# EAGLE design G223D (EAGLE 6.6.0)
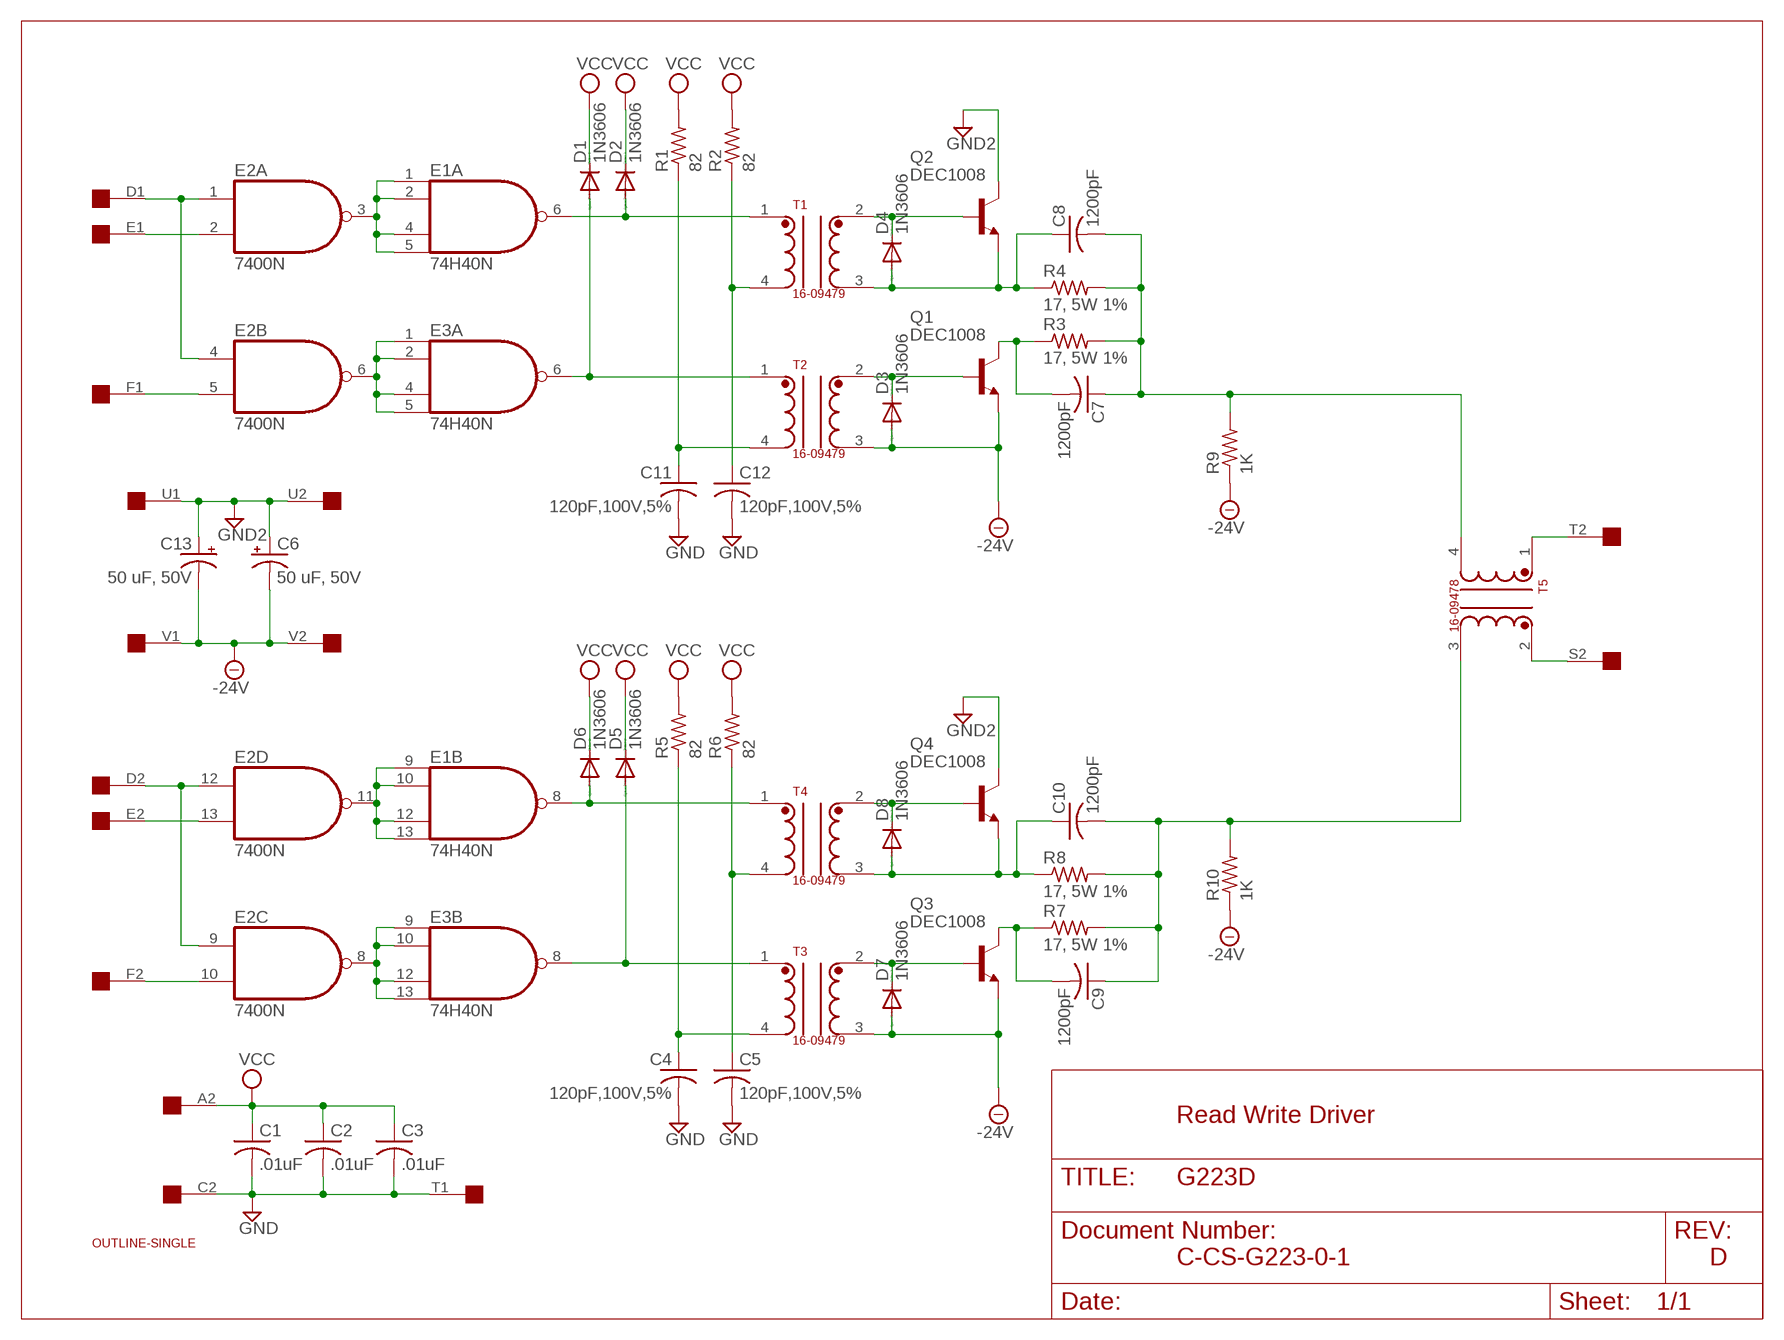
[diagram p0: schematic, sheet 1]

## Parts
C1  .01uF  C-US050-025X075  [C050-025X075]
C2  .01uF  C-US050-025X075  [C050-025X075]
C3  .01uF  C-US050-025X075  [C050-025X075]
C4  120pF,100V,5%  C-US075-032X103  [C075-032X103]
C5  120pF,100V,5%  C-US075-032X103  [C075-032X103]
C6  50 uF, 50V  CPOL-USE30-10AXIAL  [E30-10]
C7  1200pF  C-US075-032X103  [C075-032X103]
C8  1200pF  C-US075-032X103  [C075-032X103]
C9  1200pF  C-US075-032X103  [C075-032X103]
C10  1200pF  C-US075-032X103  [C075-032X103]
C11  120pF,100V,5%  C-US075-032X103  [C075-032X103]
C12  120pF,100V,5%  C-US075-032X103  [C075-032X103]
C13  50 uF, 50V  CPOL-USE30-10AXIAL  [E30-10]
D1  1N3606  DIODE-DO35-10  [DO35-10]
D2  1N3606  DIODE-DO35-10  [DO35-10]
D3  1N3606  DIODE-DO35-10  [DO35-10]
D4  1N3606  DIODE-DO35-10  [DO35-10]
D5  1N3606  DIODE-DO35-10  [DO35-10]
D6  1N3606  DIODE-DO35-10  [DO35-10]
D7  1N3606  DIODE-DO35-10  [DO35-10]
D8  1N3606  DIODE-DO35-10  [DO35-10]
E1  74H40N  74S40N  [DIL14]
E2  7400N  [DIL14]
E3  74H40N  74S40N  [DIL14]
EDGE1  EDGE-2CONNECTOR  [EDGE-CON2]
Q1  DEC1008  -NPN-TO5  [TO5]
Q2  DEC1008  -NPN-TO5  [TO5]
Q3  DEC1008  -NPN-TO5  [TO5]
Q4  DEC1008  -NPN-TO5  [TO5]
R1  82  R-US_0207/10  [0207/10]
R2  82  R-US_0207/10  [0207/10]
R3  17, 5W 1%  R-US_VTA52  [VTA52]
R4  17, 5W 1%  R-US_VTA52  [VTA52]
R5  82  R-US_0207/10  [0207/10]
R6  82  R-US_0207/10  [0207/10]
R7  17, 5W 1%  R-US_VTA52  [VTA52]
R8  17, 5W 1%  R-US_VTA52  [VTA52]
R9  1K  R-US_0207/10  [0207/10]
R10  1K  R-US_0207/10  [0207/10]
T1  16-09479  [TRANSFORMER-SIL4]
T2  16-09479  [TRANSFORMER-SIL4]
T3  16-09479  [TRANSFORMER-SIL4]
T4  16-09479  [TRANSFORMER-SIL4]
T5  16-09478  16-09479  [TRANSFORMER-SIL4]
U$1  OUTLINE-SINGLE  [SINGLE]

## Nets
-24V [supply]: C6.- C13.- D3.A D7.A EDGE1.V1 EDGE1.V2 Q1.1(E) Q3.1(E) R9.1 R10.1 T2.3 T3.3
GND [supply]: C1.2 C2.2 C3.2 C4.2 C5.2 C11.2 C12.2 EDGE1.C2 EDGE1.T1
GND2 [supply]: C6.+ C13.+ EDGE1.U1 EDGE1.U2 Q2.3(C) Q4.3(C)
N$1: E1.1(A:I0) E1.2(A:I1) E1.4(A:I2) E1.5(A:I3) E2.3(A:O)
N$2: E2.1(A:I0) E2.4(B:I0) EDGE1.D1
N$3: E2.2(A:I1) EDGE1.E1
N$4: E1.9(B:I0) E1.10(B:I1) E1.12(B:I2) E1.13(B:I3) E2.11(D:O)
N$5: E2.6(B:O) E3.1(A:I0) E3.2(A:I1) E3.4(A:I2) E3.5(A:I3)
N$6: E2.8(C:O) E3.9(B:I0) E3.10(B:I1) E3.12(B:I2) E3.13(B:I3)
N$7: E2.5(B:I1) EDGE1.F1
N$8: D2.A E1.6(A:O) T1.1
N$9: D1.A E3.6(A:O) T2.1
N$10: D6.A E1.8(B:O) T4.1
N$11: D5.A E3.8(B:O) T3.1
N$12: E2.9(C:I0) E2.12(D:I0) EDGE1.D2
N$13: E2.13(D:I1) EDGE1.E2
N$14: E2.10(C:I1) EDGE1.F2
N$15: EDGE1.S2 T5.2
N$16: EDGE1.T2 T5.1
N$17: C7.1 C8.2 R3.2 R4.2 R9.2 T5.4
N$18: C8.1 D4.A Q2.1(E) R4.1 T1.3
N$19: C7.2 Q1.3(C) R3.1
N$20: C9.1 C10.2 R7.2 R8.2 R10.2 T5.3
N$21: D7.C Q3.2(B) T3.2
N$23: C9.2 Q3.3(C) R7.1
N$24: C10.1 D8.A Q4.1(E) R8.1 T4.3
N$25: C11.1 R1.1 T2.4
N$26: C12.1 R2.1 T1.4
N$27: C5.1 R6.1 T4.4
N$28: C4.1 R5.1 T3.4
N$29: D3.C Q1.2(B) T2.2
N$30 [supply]: D4.C Q2.2(B) T1.2
N$31 [supply]: D8.C Q4.2(B) T4.2
VCC [supply]: C1.1 C2.1 C3.1 D1.C D2.C D5.C D6.C EDGE1.A2 R1.2 R2.2 R5.2 R6.2
Unconnected: E1.3(3:NC) E1.11(11:NC) E3.3(3:NC) E3.11(11:NC) EDGE1.A1 EDGE1.B1 EDGE1.B2 EDGE1.C1 EDGE1.H1 EDGE1.H2 EDGE1.J1 EDGE1.J2 EDGE1.K1 EDGE1.K2 EDGE1.L1 EDGE1.L2 EDGE1.M1 EDGE1.M2 EDGE1.N1 EDGE1.N2 EDGE1.P1 EDGE1.P2 EDGE1.R1 EDGE1.R2 EDGE1.S1

## Notes on the sheet
- Read Write Driver
- C-CS-G223-0-1 | D

## Power pins joined to a net without a drawn wire
GND: E1.7(P:GND) E2.7(P:GND) E3.7(P:GND)
VCC: E1.14(P:VCC) E2.14(P:VCC) E3.14(P:VCC)

## Library data of the parts
C1-C5 C7-C12 = rcl:C-US: CAPACITOR, American symbol
C6 C13 = rcl:CPOL-US: POLARIZED CAPACITOR, American symbol
D1-D8 = diode:DIODE-: DIODE
E1 E3 = dec-con:74*40: Dual 4-input NAND gate
E2 = 74xx-us:74*00: Quad 2-input NAND gate
EDGE1 = dec-con:EDGE-2: Double-Sided DEC edge connector.
Q1-Q4 = transistor:*-NPN-: NPN Transistror BF959 corrected 2008.03.06
R1-R10 = rcl:R-US_: RESISTOR, American symbol
T1-T5 = dec-con:16-09479: Simple Transformer
U$1 = dec-con:OUTLINE-*: Board outlines for DEC boards.

## Net classes
0 default: width 0.813 mm
1 supply: width 0.813 mm

## Board
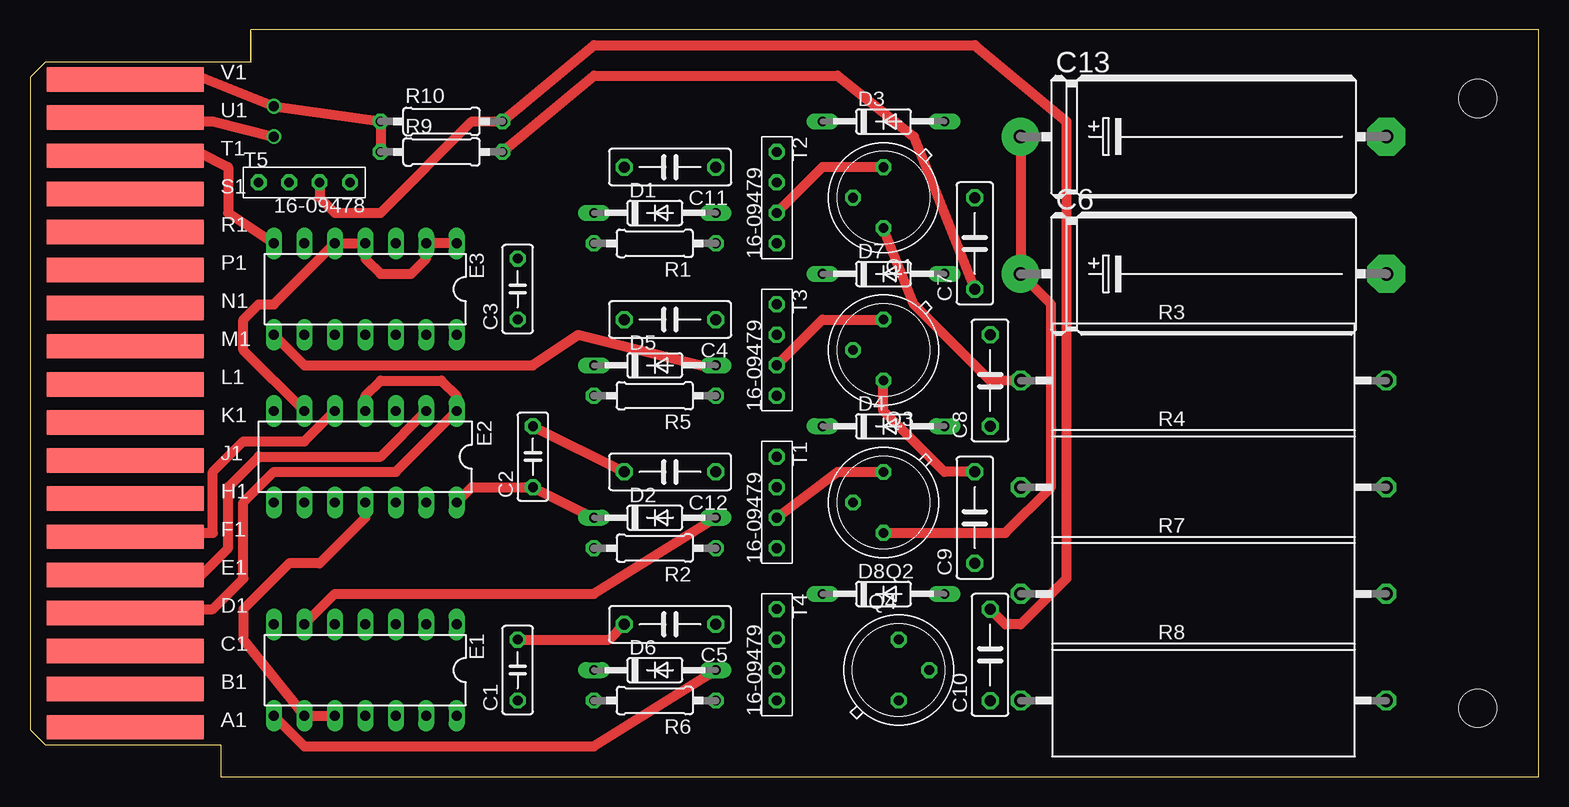
[diagram p1: board, top side]
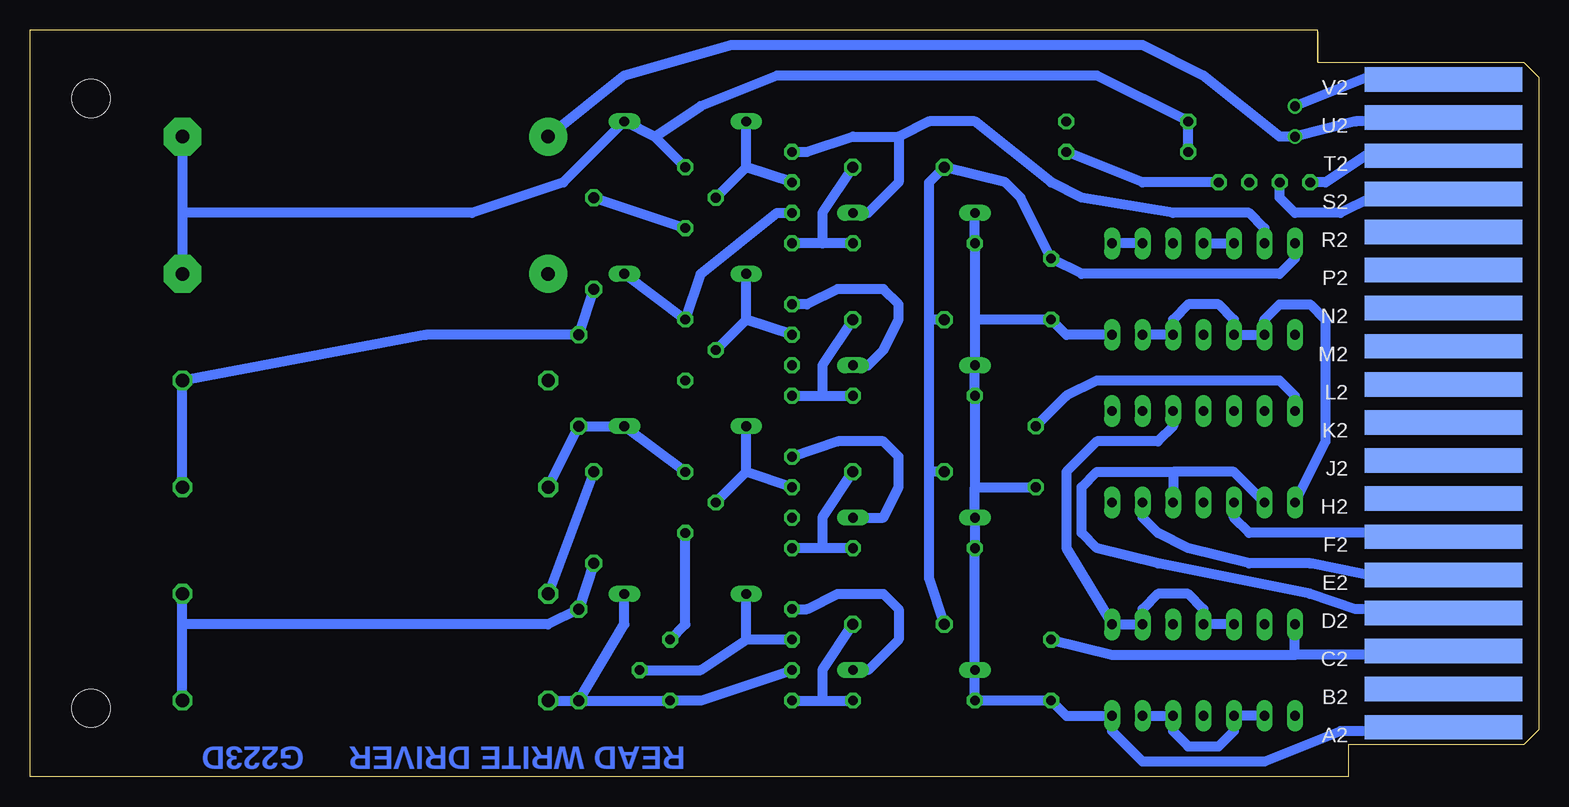
[diagram p2: board, bottom side, seen from below]

Size 125.73 x 62.23 mm. Coordinates in mm from the lower left corner, seen from the top.
Copper layers (1+16): Top 0.035mm / dielectric 1.5mm / Bottom 0.035mm
Design rules "16mils": minimum track width 16mil, minimum drill 32mil, track to track 15mil, track to pad 10mil, pad to pad 10mil, via to via 10mil, smd to smd 10mil, copper to edge 13mil, drill to drill 10mil, minimum pad ring 10mil, minimum via ring 8mil, stop-mask expansion 0mil, vias tented up to drill 0mil, thermal gap 10mil

### Footprints (pad centres in the part's own frame; a part is rotated, then mirrored left to right if it is on the bottom)
C050-025X075 = drill 0.813 octagon: 1 -2.54,0; 2 2.54,0
C075-032X103 = drill 0.914 octagon: 1 -3.81,0; 2 3.81,0
E30-10 = drill 1.118 pad 3.15: + -15.24,0 | drill 1.118 pad 3.15 octagon: - 15.24,0
DO35-10 = drill 0.813 long: A 5.08,0; C -5.08,0
DIL14 = drill 0.813 long: 1 -7.62,-3.81; 2 -5.08,-3.81; 3 -2.54,-3.81; 4 0,-3.81; 5 2.54,-3.81; 6 5.08,-3.81; 7 7.62,-3.81; 8 7.62,3.81; 9 5.08,3.81; 10 2.54,3.81; 11 0,3.81; 12 -2.54,3.81; 13 -5.08,3.81; 14 -7.62,3.81
EDGE-CON2 = smd 13.106 x 2.032: A1 7.938,4.128; B1 7.938,7.303; C1 7.938,10.477; D1 7.938,13.652; E1 7.938,16.828; F1 7.938,20.003; H1 7.938,23.177; J1 7.938,26.352; K1 7.938,29.527; L1 7.938,32.703; M1 7.938,35.877; N1 7.938,39.053; P1 7.938,42.227; R1 7.938,45.403; S1 7.938,48.578; T1 7.938,51.752; U1 7.938,54.928; V1 7.938,58.102 | smd 13.106 x 2.032 bottom: A2 7.938,4.128; B2 7.938,7.303; C2 7.938,10.477; D2 7.938,13.652; E2 7.938,16.828; F2 7.938,20.003; H2 7.938,23.177; J2 7.938,26.352; K2 7.938,29.527; L2 7.938,32.703; M2 7.938,35.877; N2 7.938,39.053; P2 7.938,42.227; R2 7.938,45.403; S2 7.938,48.578; T2 7.938,51.752; U2 7.938,54.928; V2 7.938,58.102
TO5 = drill 0.813 octagon: 1 0,-2.54; 2 2.54,0; 3 0,2.54
0207/10 = drill 0.813 octagon: 1 -5.08,0; 2 5.08,0
VTA52 = drill 1.1 octagon: 1 -15.24,0; 2 15.24,0
TRANSFORMER-SIL4 = drill 0.813 octagon: 1 -3.81,0; 2 -1.27,0; 3 1.27,0; 4 3.81,0
SINGLE = hole 3.175: 120.65,56.515; 120.65,5.715

### Placement (x,y rotation side)
C1  40.64,8.89 90 top
C2  41.91,26.67 90 top
C3  40.64,40.64 90 top
C4  53.34,38.1 180 top
C5  53.34,12.7 180 top
C6  97.79,41.91 0 top
C7  78.74,44.45 90 top
C8  80.01,33.02 90 top
C9  78.74,21.59 90 top
C10  80.01,10.16 90 top
C11  53.34,50.8 180 top
C12  53.34,25.4 180 top
C13  97.79,53.34 0 top
D1  52.07,46.99 0 top
D2  52.07,21.59 0 top
D3  71.12,54.61 0 top
D4  71.12,29.21 0 top
D5  52.07,34.29 0 top
D6  52.07,8.89 0 top
D7  71.12,41.91 0 top
D8  71.12,15.24 0 top
E1  27.94,8.89 180 top
E2  27.94,26.67 180 top
E3  27.94,40.64 180 top
EDGE1  0,0 0 top
Q1  71.12,48.26 180 top
Q2  71.12,22.86 180 top
Q3  71.12,35.56 180 top
Q4  72.39,8.89 0 top
R1  52.07,44.45 180 top
R2  52.07,19.05 180 top
R3  97.79,33.02 0 top
R4  97.79,24.13 0 top
R5  52.07,31.75 180 top
R6  52.07,6.35 180 top
R7  97.79,15.24 0 top
R8  97.79,6.35 0 top
R9  34.29,52.07 0 top
R10  34.29,54.61 0 top
T1  62.23,22.86 270 top
T2  62.23,48.26 270 top
T3  62.23,35.56 270 top
T4  62.23,10.16 270 top
T5  22.86,49.53 0 top
U$1  0,0 0 top

### Tracks (layer width: path | path; a pad name or v marks a point on that pad's centre or on a via)
-24V  (via drill 0.81)
  Top 0.813: EDGE1.V1 8.89,58.42 13.97,58.42 v20.32,55.88 R10.1 R9.1 | T3.3 66.04,38.1 Q3.1 | Q1.1 66.04,50.8 T2.3
  Bottom 0.813: EDGE1.V1 8.89,58.42 13.97,58.42 v20.32,55.88 | C13.- 113.03,46.99 | 113.03,46.99 C6.- | R9.1 R10.1 36.83,58.42 63.5,58.42 69.85,55.88 73.66,53.34 | 73.66,53.34 D3.A 81.28,49.53 88.9,46.99 113.03,46.99 | Q1.1 73.66,53.34 | D7.A Q3.1 69.85,41.91 63.5,46.99 T2.3
GND
  Top 0.813: EDGE1.T1 8.89,52.07 13.97,52.07 16.51,50.8 16.51,46.99 E3.7 | C1.2 48.26,11.43 C5.2 | C2.2 C12.2
  Bottom 0.813: EDGE1.C2 8.89,10.16 20.32,10.16 | 20.32,10.16 E1.7 | C1.2 35.56,10.16 20.32,10.16 | E3.7 20.32,43.18 21.59,41.91 38.1,41.91 C3.2 43.18,48.26 44.45,49.53 C11.2 50.8,49.53 50.8,38.1 | E2.7 20.32,31.75 21.59,33.02 36.83,33.02 39.37,31.75 C2.2 | C4.2 50.8,38.1 | C12.2 50.8,25.4 | 50.8,25.4 50.8,38.1 | C5.2 50.8,16.51 50.8,25.4
GND2  (via drill 0.81)
  Top 0.813: EDGE1.U2 8.89,54.61 15.24,54.61 v20.32,53.34 | C13.+ C6.+ 85.09,39.37 85.09,24.13 81.28,20.32 Q2.3
  Bottom 0.813: EDGE1.U2 8.26,54.61 15.24,54.61 v20.32,53.34 21.59,53.34 27.94,58.42 33.02,60.96 67.31,60.96 76.2,58.42 C13.+ | Q4.3 71.12,12.7 Q2.3
N$1
  Bottom 0.813: E1.5 E1.4 27.94,13.97 29.21,15.24 31.75,15.24 33.02,13.97 E1.2 E1.1 39.37,19.05 39.37,25.4 36.83,27.94 31.75,27.94 30.48,29.21 E2.3
N$2
  Top 0.813: EDGE1.D1 8.89,13.97 15.24,13.97 17.78,16.51 17.78,22.86 20.32,25.4 30.48,25.4 E2.1 35.56,31.75 34.29,33.02 29.21,33.02 27.94,31.75 E2.4
N$3
  Top 0.813: EDGE1.E1 8.89,16.51 13.97,16.51 16.51,19.05 16.51,24.13 19.05,26.67 29.21,26.67 E2.2
N$4
  Top 0.813: E1.10 E1.9 17.78,11.43 17.78,13.97 21.59,17.78 24.13,17.78 27.94,21.59 E2.11
  Bottom 0.813: E1.9 E1.10 25.4,3.81 26.67,2.54 29.21,2.54 30.48,3.81 E1.12 E1.13
N$5
  Top 0.813: E2.6 17.78,35.56 17.78,38.1 19.05,39.37 20.32,39.37 E3.5 E3.4 27.94,43.18 29.21,41.91 31.75,41.91 33.02,43.18 E3.2 E3.1
  Bottom 0.813: E3.4 E3.5 | E3.2 E3.1
N$6
  Bottom 0.813: E2.8 17.78,27.94 17.78,38.1 19.05,39.37 21.59,39.37 22.86,38.1 E3.9 E3.10 25.4,38.1 26.67,39.37 29.21,39.37 30.48,38.1 E3.12 E3.13
N$7
  Top 0.813: EDGE1.F1 8.89,20.32 15.24,20.32 15.24,25.4 17.78,27.94 22.86,27.94 E2.5
N$8
  Top 0.813: E1.6 25.4,15.24 46.99,15.24 D2.A
  Bottom 0.813: D2.A 54.61,21.59 53.34,24.13 53.34,26.67 54.61,27.94 58.42,27.94 T1.1
N$9
  Bottom 0.813: T2.1 60.96,52.07 57.15,53.34 53.34,53.34 | 53.34,53.34 53.34,49.53 55.88,46.99 D1.A | E3.6 22.86,45.72 24.13,46.99 30.48,46.99 38.1,48.26 40.64,49.53 46.99,54.61 50.8,54.61 53.34,53.34
N$10
  Top 0.813: E1.8 22.86,2.54 46.99,2.54 D6.A
  Bottom 0.813: T4.1 60.96,13.97 58.42,15.24 54.61,15.24 53.34,13.97 53.34,11.43 55.88,8.89 D6.A
N$11
  Top 0.813: E3.8 22.86,34.29 41.91,34.29 45.72,36.83 55.88,34.29 D5.A
  Bottom 0.813: D5.A 55.88,34.29 54.61,35.56 53.34,38.1 53.34,39.37 54.61,40.64 58.42,40.64 60.96,39.37 T3.1
N$12
  Bottom 0.813: E2.9 25.4,25.4 30.48,25.4 | 30.48,25.4 E2.12 | EDGE1.D2 8.89,13.97 15.24,13.97 19.05,15.24 31.75,17.78 36.83,19.05 38.1,20.32 38.1,24.13 36.83,25.4 30.48,25.4
N$13
  Bottom 0.813: EDGE1.E2 8.89,16.51 12.7,16.51 19.05,17.78 24.13,17.78 29.21,19.05 31.75,20.32 33.02,21.59 E2.13
N$14
  Bottom 0.813: EDGE1.F2 8.89,20.32 24.13,20.32 25.4,21.59 E2.10
N$15
  Bottom 0.813: EDGE1.S2 8.89,48.26 13.97,48.26 16.51,46.99 20.32,46.99 21.59,48.26 T5.2
N$16
  Bottom 0.813: EDGE1.T2 8.89,52.07 13.97,52.07 17.78,49.53 T5.1
N$17
  Top 0.813: R9.2 46.99,58.42 67.31,58.42 73.66,53.34 C7.1
  Bottom 0.813: T5.4 33.02,49.53 R9.2 | C7.1 C8.2 92.71,36.83 R3.2 R4.2
N$18
  Top 0.813: T1.3 67.31,25.4 Q2.1
  Bottom 0.813: Q2.1 D4.A C8.1 R4.1
N$19
  Top 0.813: R3.1 80.01,33.02 73.66,39.37 Q1.3
  Bottom 0.813: Q1.3 C7.2
N$20
  Top 0.813: T5.3 24.13,48.26 25.4,46.99 29.21,46.99 36.83,54.61 R10.2 46.99,60.96 78.74,60.96 86.36,54.61 86.36,16.51 82.55,12.7 81.28,12.7 C10.2
  Bottom 0.813: C9.1 C10.2 82.55,12.7 113.03,12.7 | R8.2 113.03,12.7 | 113.03,12.7 R7.2
N$21
  Bottom 0.813: T3.2 66.04,38.1 | 66.04,38.1 D7.C | Q3.2 66.04,38.1
N$23
  Top 0.813: C9.2 76.2,25.4 71.12,30.48 Q3.3
  Bottom 0.813: C9.2 R7.1
N$24
  Bottom 0.813: T4.3 69.85,6.35 Q4.1 C10.1 | C10.1 76.2,12.7 D8.A | R8.1 C10.1
N$25
  Bottom 0.813: C11.1 59.69,46.99 59.69,44.45 | 59.69,44.45 T2.4 | R1.1 59.69,44.45
N$26
  Bottom 0.813: R2.1 59.69,19.05 | 59.69,19.05 T1.4 | C12.1 59.69,21.59 59.69,19.05
N$27
  Bottom 0.813: C5.1 59.69,8.89 59.69,6.35 | 59.69,6.35 R6.1 | T4.4 59.69,6.35
N$28
  Bottom 0.813: T3.4 59.69,31.75 | 59.69,31.75 R5.1 | C4.1 59.69,34.29 59.69,31.75
N$29
  Bottom 0.813: T2.2 66.04,50.8 | 66.04,50.8 D3.C | Q1.2 66.04,50.8
N$30
  Bottom 0.813: T1.2 66.04,25.4 | 66.04,25.4 D4.C | Q2.2 66.04,25.4
N$31
  Bottom 0.813: T4.2 66.04,11.43 | 66.04,11.43 D8.C | Q4.2 69.85,8.89 66.04,11.43
VCC
  Top 0.813: E2.14 36.83,24.13 C2.1 D2.C
  Bottom 0.813: EDGE1.A2 8.26,3.81 16.51,3.81 22.86,1.27 33.02,1.27 35.56,3.81 E1.14 39.37,5.08 C1.1 R6.2 D6.C R2.2 D2.C 46.99,24.13 | E3.14 39.37,36.83 C3.1 46.99,38.1 | D1.C R1.2 46.99,38.1 | 46.99,24.13 C2.1 | 46.99,24.13 R5.2 D5.C 46.99,38.1

### Text on the board
Bottom: READ WRITE DRIVER | G223D